# Altium schematic sheet cell_ballance_r.SchDoc
size A4; SheetNumber: 3; SheetTotal: 7
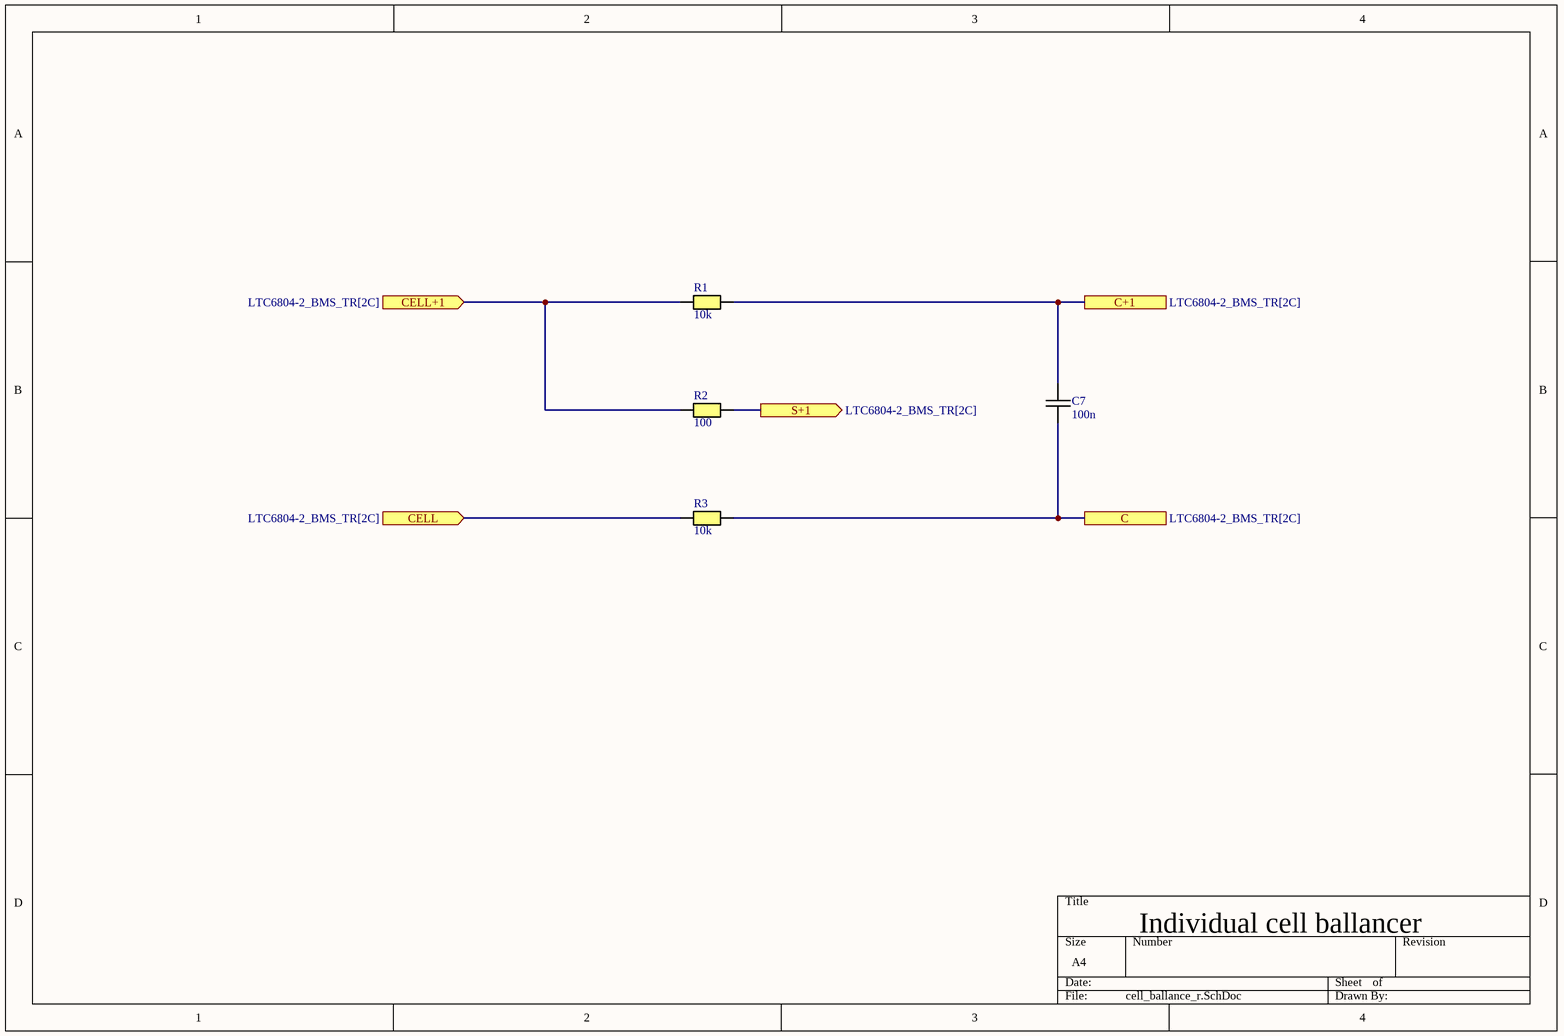
[diagram p0: cell_ballance_r.SchDoc]

## Parts
C7  100n  [CAPC0603(1608)55_N]
R1  10k  [RESC0603(1608)_N]
R2  100  [RESC0805(2012)_N]
R3  10k  [RESC0603(1608)_N]

## Ports
C (see LTC6804-2_BMS_TR[2C]), C+1 (see LTC6804-2_BMS_TR[2C]), CELL (in, see LTC6804-2_BMS_TR[2C]), CELL+1 (in, see LTC6804-2_BMS_TR[2C]), S+1 (out, see LTC6804-2_BMS_TR[2C])

## Nets
C: C7.2 R3.2 ; port C
C+1: C7.1 R1.2 ; port C+1
CELL: R3.1 ; port CELL
CELL+1: R1.1 R2.1 ; port CELL+1
S+1: R2.2 ; port S+1

## Notes on the sheet
- Individual cell ballancer

## Library data of the parts
C7 = Capacitor M: Ceramic capacitor Medium density; Value: 100n
R1-R3 = Resistor M: Resistor Medium Density
  R1 R3: Value: 10k
  R2: Value: 100